# Altium schematic sheet USB_CP2102.SchDoc
size A; SheetNumber: 2; SheetTotal: 4
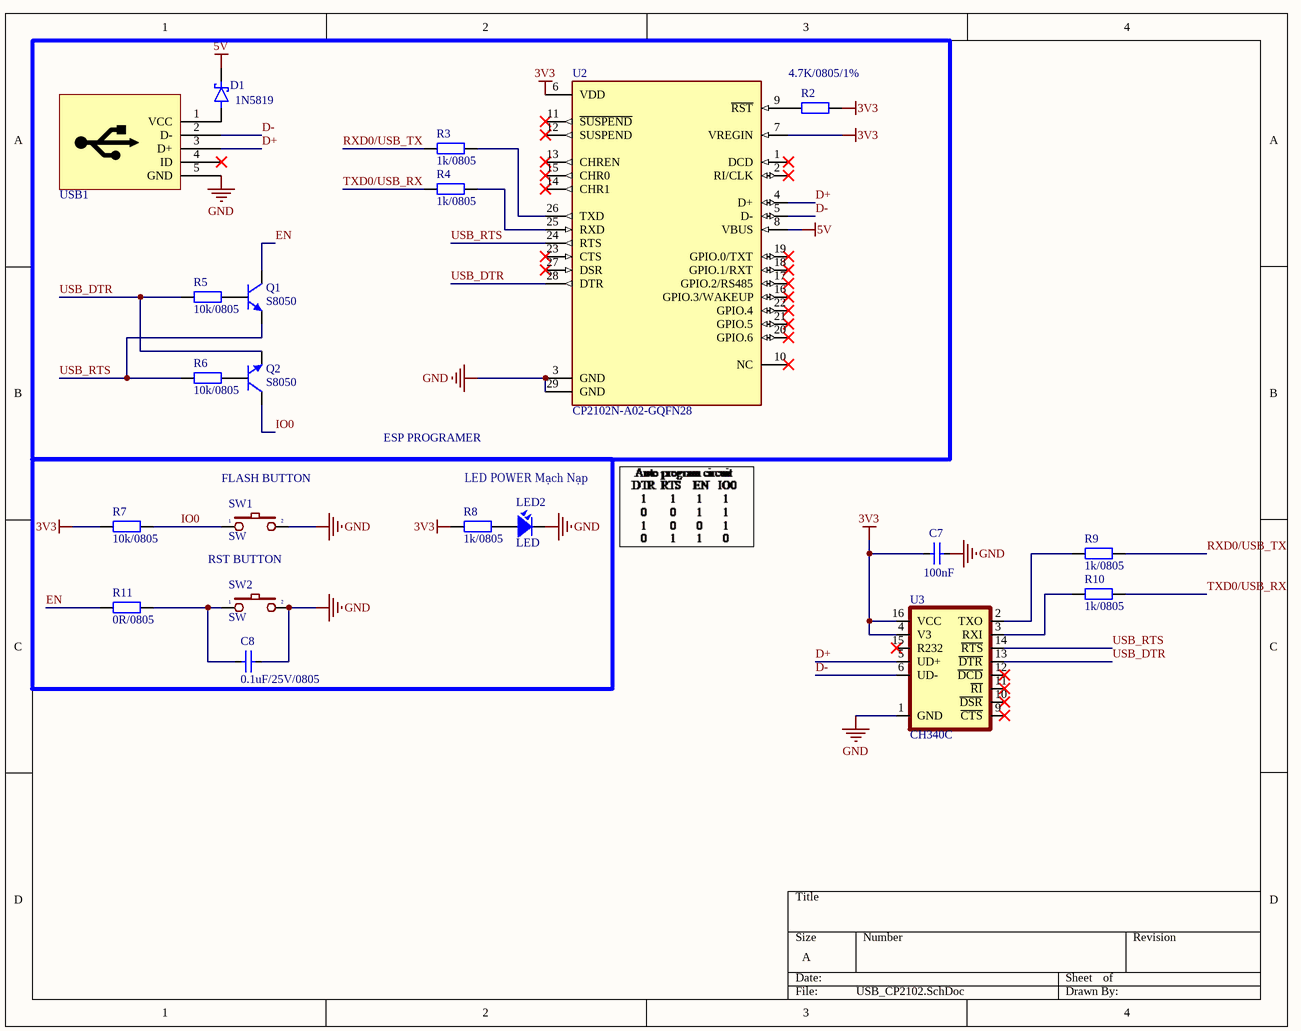
[diagram p0: USB_CP2102.SchDoc]

## Parts
C7  100nF  [CAP_0402]
C8  0.1uF/25V/0805  [CAP_0805]
D1  1N5819  [SOD3715X145N]
LED2  LED  [LED-0805-Green]
Q1  S8050  [SOT23]
Q2  S8050  [SOT23]
R2  4.7K/0805/1%  [RES-SMD-0805]
R3  1k/0805  [RES-SMD-0805]
R4  1k/0805  [RES-SMD-0805]
R5  10k/0805  [RES-SMD-0805]
R6  10k/0805  [RES-SMD-0805]
R7  10k/0805  [RES-SMD-0805]
R8  1k/0805  [RES-SMD-0805]
R9  1k/0805  [RES-SMD-0805]
R10  1k/0805  [RES-SMD-0805]
R11  0R/0805  [RES-SMD-0805]
SW1  SW  [SW-SMD]
SW2  SW  [SW-SMD]
U2  CP2102N-A02-GQFN28  [QFN50P500X500X80-29N]
U3  CH340C  [SOP-16]
USB1  USB  [HRS_ZX62D-B-5P8]  (value not drawn)

## Blocks framed on the sheet
ESP PROGRAMER: D1 Q1 Q2 R2-R6 U2 USB1

## Nets
3V3: C7.1 R2.1 R7.2 R8.2 U2.6(VDD) U2.7(VREGIN) U3.4(V3) U3.16(VCC)
5V: D1.C(K) U2.8(VBUS)
GND: C7.2 C8.2 LED2.2 SW1.2 SW2.2 U2.3(GND) U2.29(GND) U3.1(GND) USB1.5(GND)
D+: U2.4(D+) U3.5(UD+) USB1.3(D+)
D-: U2.5(D-) U3.6(UD-) USB1.2(D-)
EN: Q1.2(C) R11.2
IO0: Q2.2(C) R7.1 SW1.1
RXD0/USB_TX: R3.2 R9.2
TXD0/USB_RX: R4.2 R10.2
USB_DTR: Q2.1(E) R5.2 U2.28(DTR) U3.13(~{DTR})
USB_RTS: Q1.1(E) R6.2 U2.24(RTS) U3.14(~{RTS})
NetC8_1: C8.1 R11.1 SW2.1
NetD1_A: D1.A USB1.1(VCC)
NetLED2_1: LED2.1 R8.1
NetQ1_3: Q1.3(B) R5.1
NetQ2_3: Q2.3(B) R6.1
NetR2_2: R2.2 U2.9(~{RST})
NetR3_1: R3.1 U2.26(TXD)
NetR4_1: R4.1 U2.25(RXD)
NetR9_1: R9.1 U3.2(TXO)
NetR10_1: R10.1 U3.3(RXI)

Not connected (* = marked no-connect by the designer): U2 1(DCD)* 2(RI/CLK)* 10(NC)* 11(~{SUSPEND})* 12(SUSPEND)* 13(CHREN)* 14(CHR1)* 15(CHR0)* 16(GPIO.3/WAKEUP)* 17(GPIO.2/RS485)* 18(GPIO.1/RXT)* 19(GPIO.0/TXT)* 20(GPIO.6)* 21(GPIO.5)* 22(GPIO.4)* 23(CTS)* 27(DSR)*; U3 9(~{CTS})* 10(~{DSR})* 11(~{RI})* 12(~{DCD})* 15(R232)*; USB1 4(ID)*

## Notes on the sheet
- (near SW1) FLASH BUTTON
- LED POWER Mạch Nạp
- RST BUTTON

## Library data of the parts
C7 C8 = CapSMD: Capacitor; Value: 33p; Published: 8-Jun-2000; LatestRevisionDate: 17-Jul-2002; LatestRevisionNote: Re-released for DXP Platform.; PackageReference: RAD-0.3; Publisher: Altium Limited
D1 = 1N5819HW-7-F: Diode Schottky 40 V 1A Surface Mount SOD-123; MF: Diodes Inc.; Value: *; SnapEDA_Link: https://www.snapeda.com/parts/1N5819HW-7-F/Diodes+Inc./view-part/?ref=snap; Purchase-URL: https://pricing.snapeda.com/search/part/1N5819HW-7-F/?ref=eda; Availability: In Stock; Price: None; Package: SOD-123 Fairchild Semiconductor; Check_prices: https://www.snapeda.com/parts/1N5819HW-7-F/Diodes+Inc./view-part/?ref=eda; MP: 1N5819HW-7-F
LED2 = LED: LED Single colour Green and Red; Value: LED 3 ly Single Colour
Q1 Q2 = NPN: NPN General; Published: 8-Jun-2000; LatestRevisionDate: 15-Jan-2003; LatestRevisionNote: PCB Footprint 'BCY-W3/D4.7' replaced; DatasheetDocument: 1997; PackageDocument: Sep-1998; PackageReference: TO-92A; Publisher: Altium Limited; Code_JEDEC: TO-92A; ComponentLink1Description: Manufacturer Link; ComponentLink1URL: http://www.fairchildsemi.com/; ComponentLink2Description: Datasheet; ComponentLink2URL: http://www.fairchildsemi.com/ds/2N%2F2N3904.pdf
R2-R11 = Resistor - SMD: Resistor SMD; Manufacturer: Generic Components; Class: Passive; Published: 08/06/2000; Publisher: Altium Hobart Technology Centre
SW1 SW2 = SW2: Switch button 2 pin; Value: SW chip 2 pin
U2 = CP2102N-A02-GQFN28: USB Bridge, USB to UART USB 2.0 UART Interface 28-QFN (5x5); MF: Silicon Labs; Value: *; Price: None; Package: WFQFN-28 Silicon Labs; Check_prices: https://www.snapeda.com/parts/CP2102N-A02-GQFN28/Silicon+Labs/view-part/?ref=eda; Availability: In Stock; SnapEDA_Link: https://www.snapeda.com/parts/CP2102N-A02-GQFN28/Silicon+Labs/view-part/?ref=snap; Purchase-URL: https://pricing.snapeda.com/search/part/CP2102N-A02-GQFN28/?ref=eda; MP: CP2102N-A02-GQFN28
U3 = CH340C: USB to serial chip CH340; MF: WCH; Package: Package; Check_prices: https://www.snapeda.com/parts/CH340C/WCH/view-part/5428851/?ref=eda; Value: *; Price: None; MP: CH340C; Availability: Unavailable; SnapEDA_Link: https://www.snapeda.com/parts/CH340C/WCH/view-part/5428851/?ref=snap
USB1 = USB-M